# EAGLE design pcb_univ_3-101-0-x-rev1 (EAGLE 5.11)
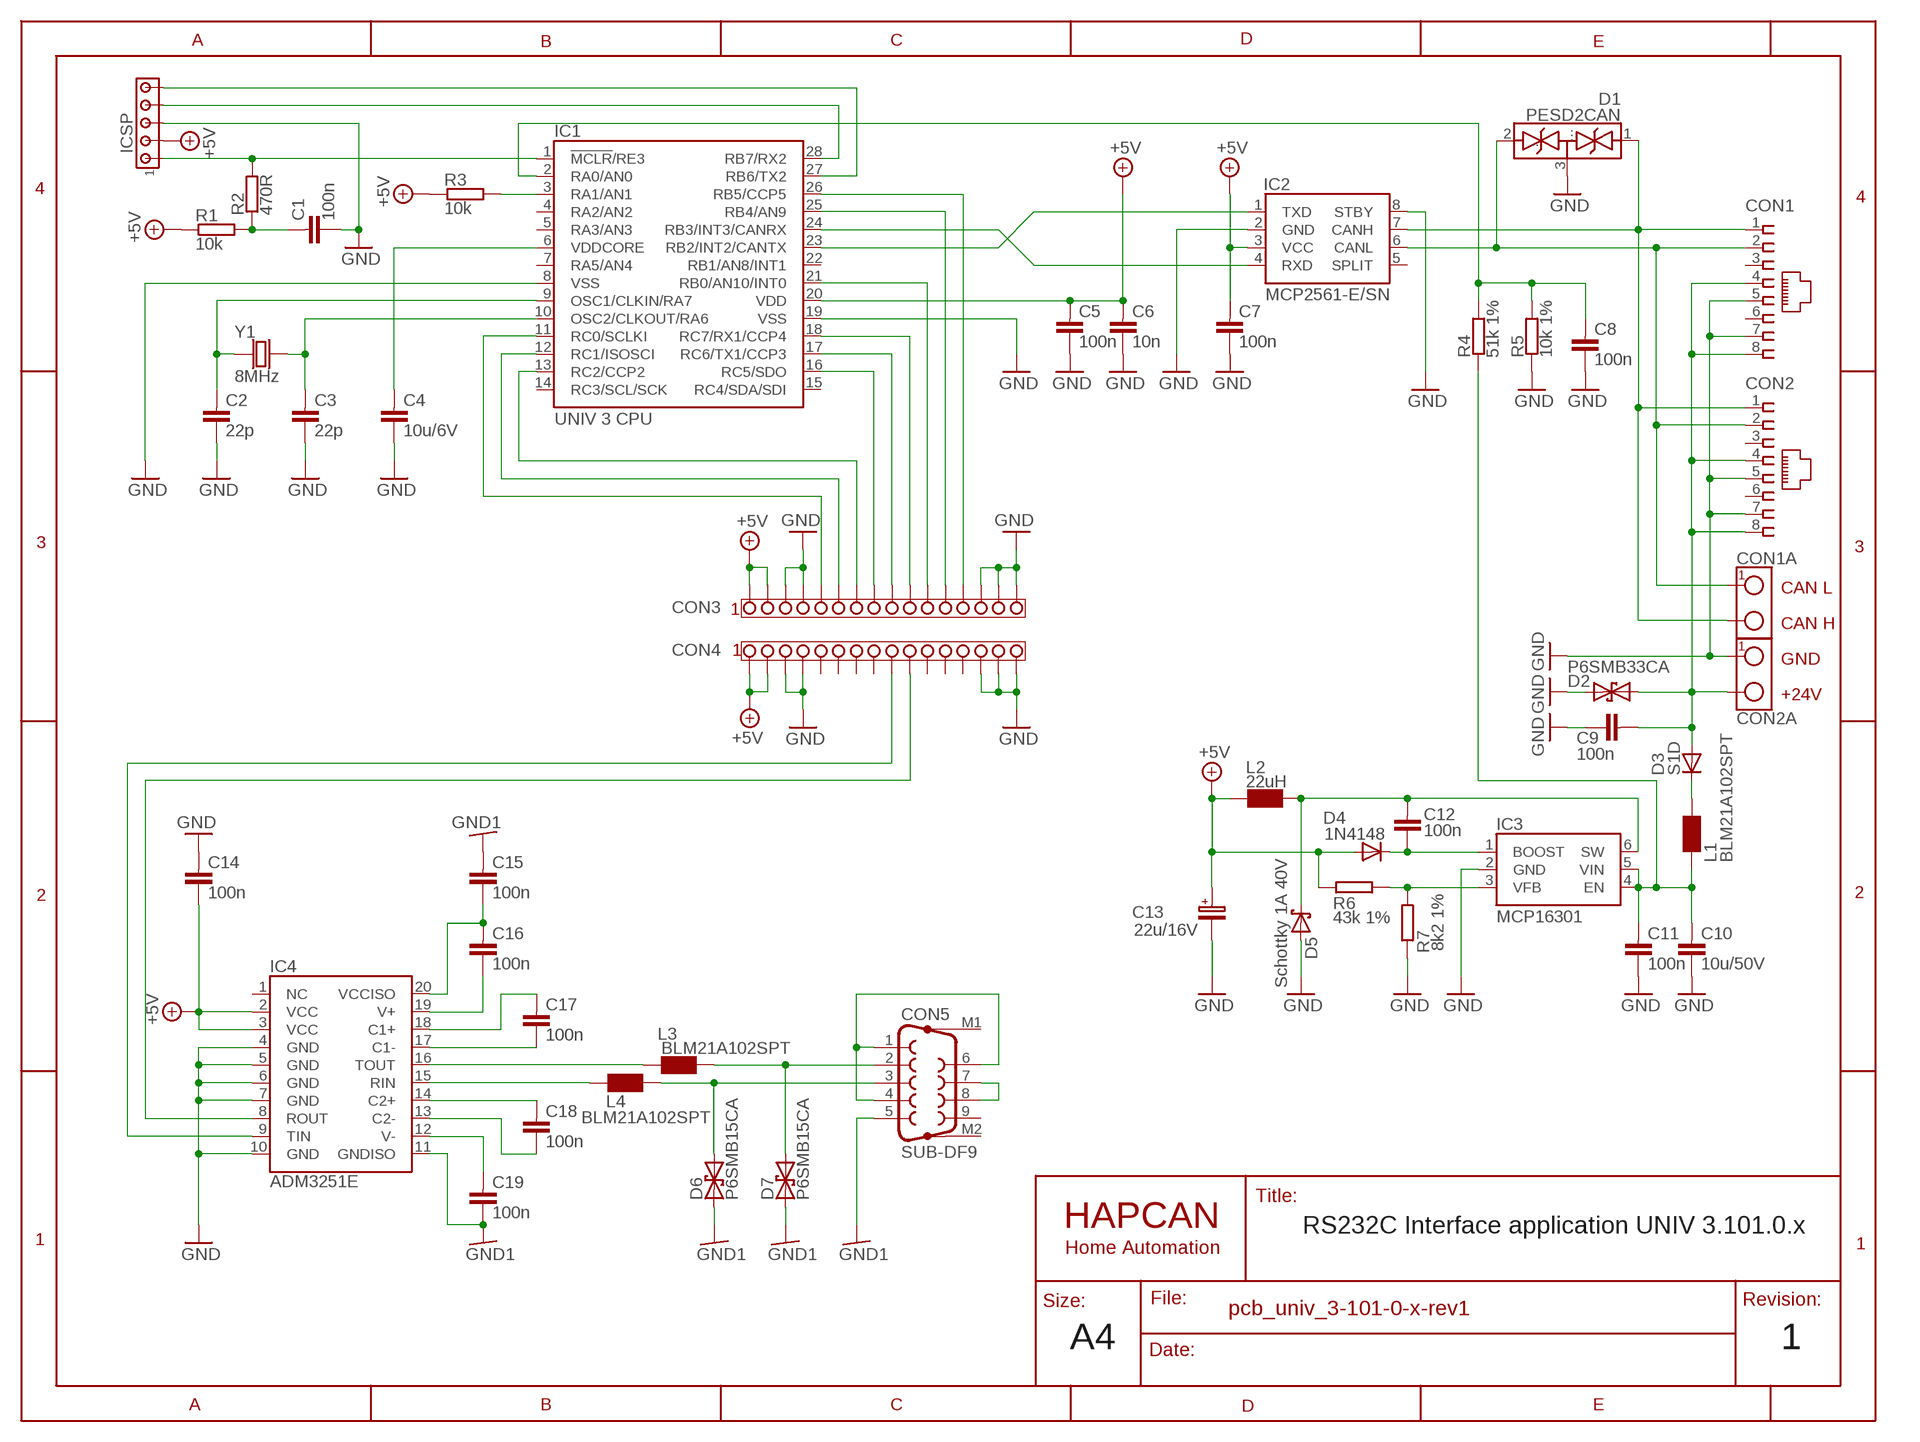
[diagram p0: schematic, sheet 1]

## Parts
C1  100n  CAPACITOR0805  [0805]
C2  22p  CAPACITOR0805  [0805]
C3  22p  CAPACITOR0805  [0805]
C4  10u/6V  CAPACITOR0805  [0805]
C5  100n  CAPACITOR0805  [0805]
C6  10n  CAPACITOR0805  [0805]
C7  100n  CAPACITOR0805  [0805]
C8  100n  CAPACITOR0805  [0805]
C9  100n  CAPACITOR0805  [0805]
C10  10u/50V  CAPACITOR1210  [1210]
C11  100n  CAPACITOR0805  [0805]
C12  100n  CAPACITOR0805  [0805]
C13  22u/16V  CAPACITOR-POLARIZED-SMC_B  [SMC_B]
C14  100n  CAPACITOR0805  [0805]
C15  100n  CAPACITOR0805  [0805]
C16  100n  CAPACITOR0805  [0805]
C17  100n  CAPACITOR0805  [0805]
C18  100n  CAPACITOR0805  [0805]
C19  100n  CAPACITOR0805  [0805]
CON1  RJ45-SOCKET  [RJ45-PCB-SOCKET]
CON1A  TERMINAL-2  TERMINAL-2-5X10,5MM  [ARK2-5X10,5MM]
CON2  RJ45-SOCKET  [RJ45-PCB-SOCKET]
CON2A  TERMINAL-2  TERMINAL-2-5X10,5MM  [ARK2-5X10,5MM]
CON3  CONNECTOR-16PINNORMAL  [CONNECTOR-16PIN]
CON4  CONNECTOR-16PINMIRRORED  [CONNECTOR-16PIN-REVERSED]
CON5  SUB-DF9  [SUB-D9FH-7.2MM]
D1  PESD2CAN  PESD2CANSOT-23  [SOT-23]
D2  P6SMB33CA  DIODE_TRANSIL  [DO-214_TRANSIL2]
D3  S1D  DIODE_DO-214  [DO-214]
D4  1N4148  DIODE_0805  [0805]
D5  Schottky 1A 40V  DIODE_TRANSIL1  [DO-214]
D6  P6SMB15CA  DIODE_TRANSIL  [DO-214_TRANSIL2]
D7  P6SMB15CA  DIODE_TRANSIL  [DO-214_TRANSIL2]
IC1  UNIV 3 CPU  UNIV3(CPU)  [UNIV3CPU]
IC2  MCP2561-E/SN  [SO-08]
IC3  MCP16301  MCP16301SOT23-6  [SOT-23-6]
IC4  ADM3251E  [SOW-20]
ICSP  HEADER5  [SIP-5]
L1  BLM21A102SPT  CHOKE0805  [0805]
L2  22uH  CHOKEDL16  [CHOKE-DL16]
L3  BLM21A102SPT  CHOKE0805  [0805]
L4  BLM21A102SPT  CHOKE0805  [0805]
R1  10k  RESISTOR0805  [0805]
R2  470R  RESISTOR0805  [0805]
R3  10k  RESISTOR0805  [0805]
R4  51k 1%  RESISTOR0805  [0805]
R5  10k 1%  RESISTOR0805  [0805]
R6  43k 1%  RESISTOR0805  [0805]
R7  8k2 1%  RESISTOR0805  [0805]
Y1  8MHz  CRYSTAL-HC49V  [CRYSTAL-HC49V]

## Nets
+5V: C5.1 C6.1 C7.1 C13.+ C14.2 CON3.1 CON3.2 CON4.1 CON4.2 D4.2(A) IC1.20(VDD) IC2.3(VCC) IC4.2(VCC) IC4.3(VCC) ICSP.2 L2.1 R1.1 R3.1 R6.1
GND: C1.2 C2.2 C3.2 C4.2 C5.2 C6.2 C7.2 C8.2 C9.2 C10.2 C11.2 C13.- C14.1 CON1.5 CON1.7 CON2.5 CON2.7 CON2A.1 CON3.3 CON3.4 CON3.14 CON3.15 CON3.16 CON4.3 CON4.4 CON4.14 CON4.15 CON4.16 D1.3(...) D2.C D5.A IC1.8(VSS) IC1.19(VSS) IC2.2(GND) IC2.8(STBY) IC3.2(GND) IC4.4(GND) IC4.5(GND) IC4.6(GND) IC4.7(GND) IC4.10(GND) ICSP.3 R5.1 R7.1
GNDIO: C15.1 C19.2 CON5.5 D6.C D7.C IC4.11(GNDISO) ; supply symbol labelled GND1
ICSP: IC1.1(!MCLR!/RE3) ICSP.1 R2.2
N$1: C18.2 IC4.13(C2-)
N$2: IC1.24(RB3/INT3/CANRX) IC2.4(RXD)
N$3: IC1.23(RB2/INT2/CANTX) IC2.1(TXD)
N$4: CON5.2 D7.A L3.1
N$5: C12.1 D5.C IC3.6(SW) L2.2
N$6: IC3.3(VFB) R6.2 R7.2
N$7: C1.1 R1.2 R2.1
N$8: C8.1 IC1.2(RA0/AN0) R4.2 R5.2
N$9: CON1.1 CON1A.2 CON2.1 D1.1(.) IC2.7(CANH)
N$10: IC1.28(RB7/RX2) ICSP.4
N$11: C2.1 IC1.9(OSC1/CLKIN/RA7) Y1.1
N$12: IC1.3(RA1/AN1) R3.2
N$13: CON1.2 CON1A.1 CON2.2 D1.2(..) IC2.6(CANL)
N$14: IC1.27(RB6/TX2) ICSP.5
N$15: C3.1 IC1.10(OSC2/CLKOUT/RA6) Y1.2
N$18: C10.1 C11.1 IC3.4(EN) IC3.5(VIN) L1.1 R4.1
N$19: CON5.3 D6.A L4.1
N$20: CON5.1 CON5.4 CON5.6
N$21: CON5.7 CON5.8
N$22: IC4.16(TOUT) L3.2
N$24: IC4.15(RIN) L4.2
N$25: C17.2 IC4.17(C1-)
N$26: C18.1 IC4.14(C2+)
N$27: C17.1 IC4.18(C1+)
N$29: CON3.9 IC1.17(RC6/TX1/CCP3)
N$30: CON3.8 IC1.16(RC5/SDO)
N$31: C16.2 IC4.19(V+)
N$32: CON3.7 IC1.13(RC2/CCP2)
N$33: CON3.10 IC1.18(RC7/RX1/CCP4)
N$34: C15.2 C16.1 IC4.20(VCCISO)
N$35: C19.1 IC4.12(V-)
N$37: CON4.10 IC4.8(ROUT)
N$38: C12.2 D4.1(C) IC3.1(BOOST)
N$41: CON4.9 IC4.9(TIN)
N$47: CON3.6 IC1.12(RC1/ISOSCI)
N$48: CON3.5 IC1.11(RC0/SCLKI)
N$51: CON3.11 IC1.21(RB0/AN10/INT0)
N$52: CON3.13 IC1.26(RB5/CCP5)
N$54: CON3.12 IC1.25(RB4/AN9)
N$56: C4.1 IC1.6(VDDCORE)
N$59: C9.1 CON1.4 CON1.8 CON2.4 CON2.8 CON2A.2 D2.A D3.A
N$61: D3.C L1.2
Unconnected: CON1.3 CON1.6 CON2.3 CON2.6 CON4.5 CON4.6 CON4.7 CON4.8 CON4.11 CON4.12 CON4.13 CON5.9 CON5.M1(G1) CON5.M2(G2) IC1.4(RA2/AN2) IC1.5(RA3/AN3) IC1.7(RA5/AN4) IC1.14(RC3/SCL/SCK) IC1.15(RC4/SDA/SDI) IC1.22(RB1/AN8/INT1) IC2.5(SPLIT) IC4.1(NC)

## Notes on the sheet
- CAN L
- CON3 | 1
- CAN H
- CON4 | 1
- GND
- +24V
- RS232C Interface application UNIV 3.101.0.x
- A4 | 1

## Library data of the parts
C1-C12 C14-C19 = HAPCAN_devices - UNIV3:CAPACITOR: HAPCAN Capacitor
C13 = HAPCAN_devices - UNIV3:CAPACITOR-POLARIZED: HAPCAN Polarazied Capacitor
CON1 CON2 = HAPCAN_devices - UNIV3:RJ45-SOCKET: HAPCAN RJ45 socket
CON1A CON2A = HAPCAN_devices - UNIV3:TERMINAL-2: HAPCAN Terminal Block - 2 way
CON3 CON4 = HAPCAN_devices - UNIV3:CONNECTOR-16PIN: 16pin connector 2.54 raster
CON5 = HAPCAN_devices - UNIV3:SUB-DF9: HAPCAN SUB-D 9 pin female connector
D1 = HAPCAN_devices - UNIV3:PESD2CAN: CAN bus ESD protection diode
D2 D6 D7 = HAPCAN_devices - UNIV3:DIODE_TRANSIL: Transil diode
D3 D4 = HAPCAN_devices - UNIV3:DIODE: HAPCAN Rectifier Diode
D5 = HAPCAN_devices - UNIV3:DIODE_TRANSIL1: HAPCAN Unidirectional transil diode
IC1 = HAPCAN_devices - UNIV3:UNIV3(CPU): HAPCAN Microcontroller UNIV 3 (CPU)
IC2 = HAPCAN_devices - UNIV3:MCP2561: HAPCAN CAN Tranceiver
IC3 = HAPCAN_devices - UNIV3:MCP16301: High Voltage Input Integrated Switch Step-Down Regulator
IC4 = HAPCAN_devices - UNIV3:ADM3251E: RS232C isolated transceiver
ICSP = HAPCAN_devices - UNIV3:HEADER5: HAPCAN Header 5
L1-L4 = HAPCAN_devices - UNIV3:CHOKE: Choke
R1-R7 = HAPCAN_devices - UNIV3:RESISTOR: HAPCAN Resistor
Y1 = HAPCAN_devices - UNIV3:CRYSTAL: HAPCAN Crystal

## Board
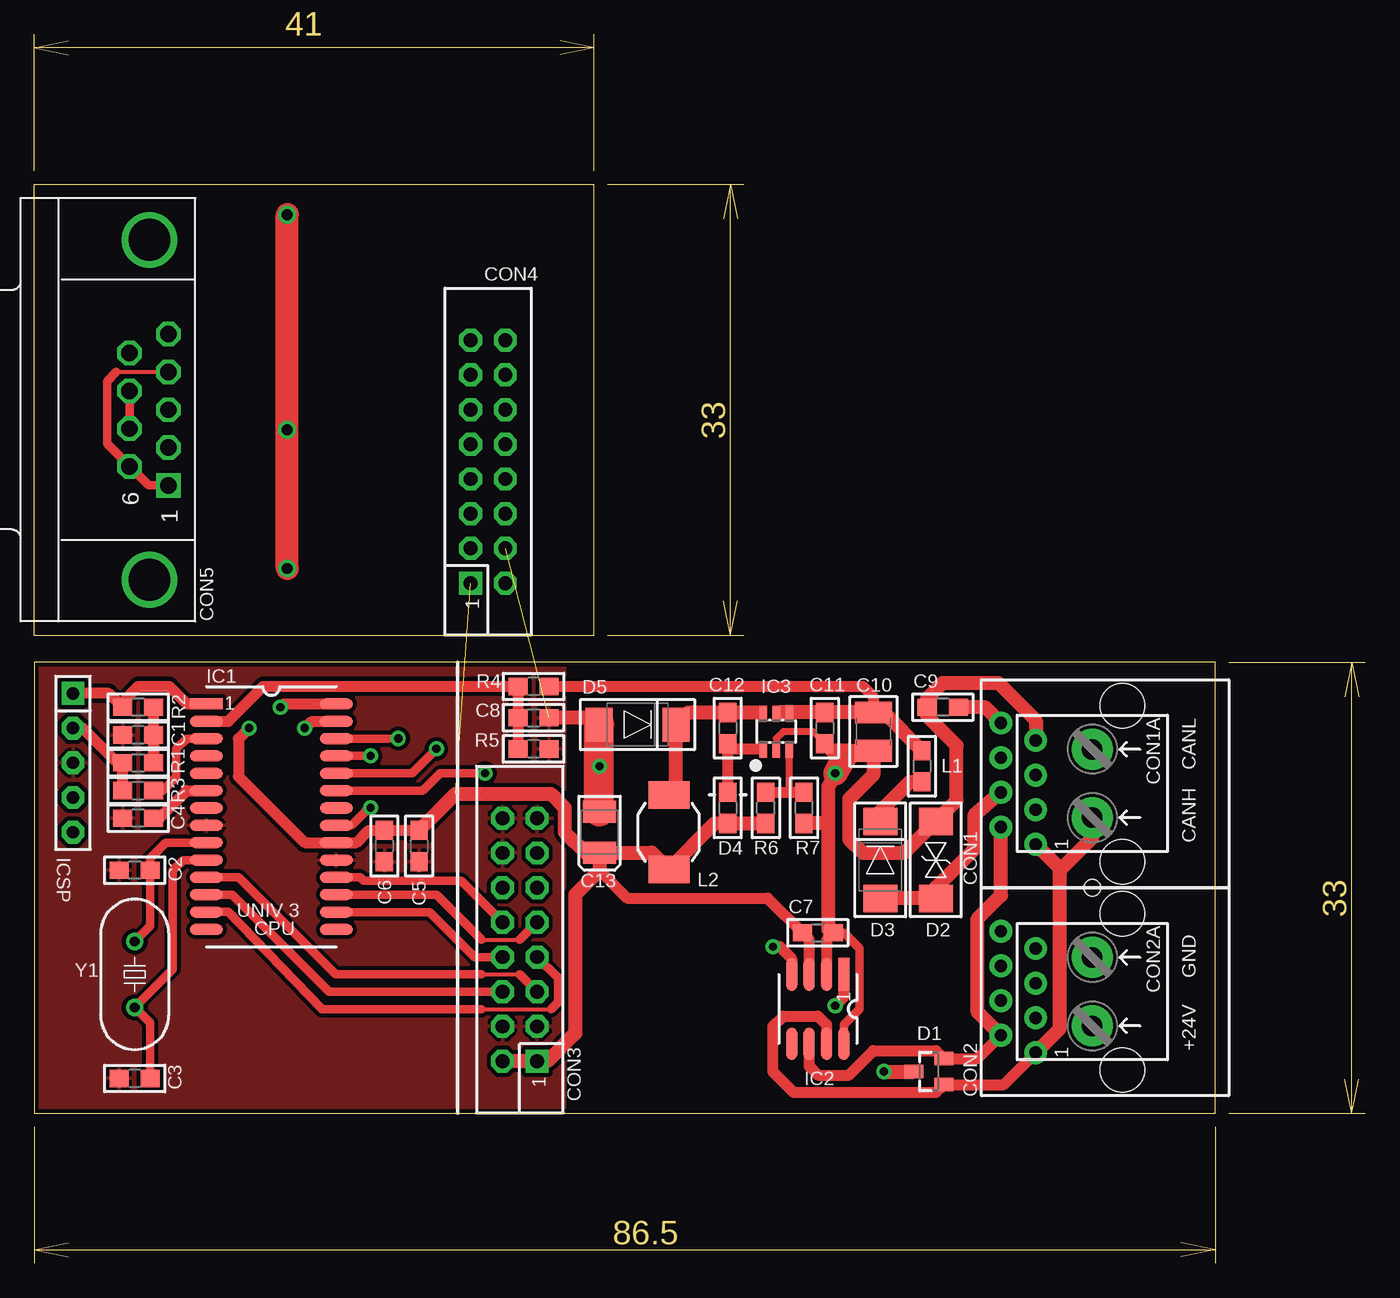
[diagram p1: board, top side]
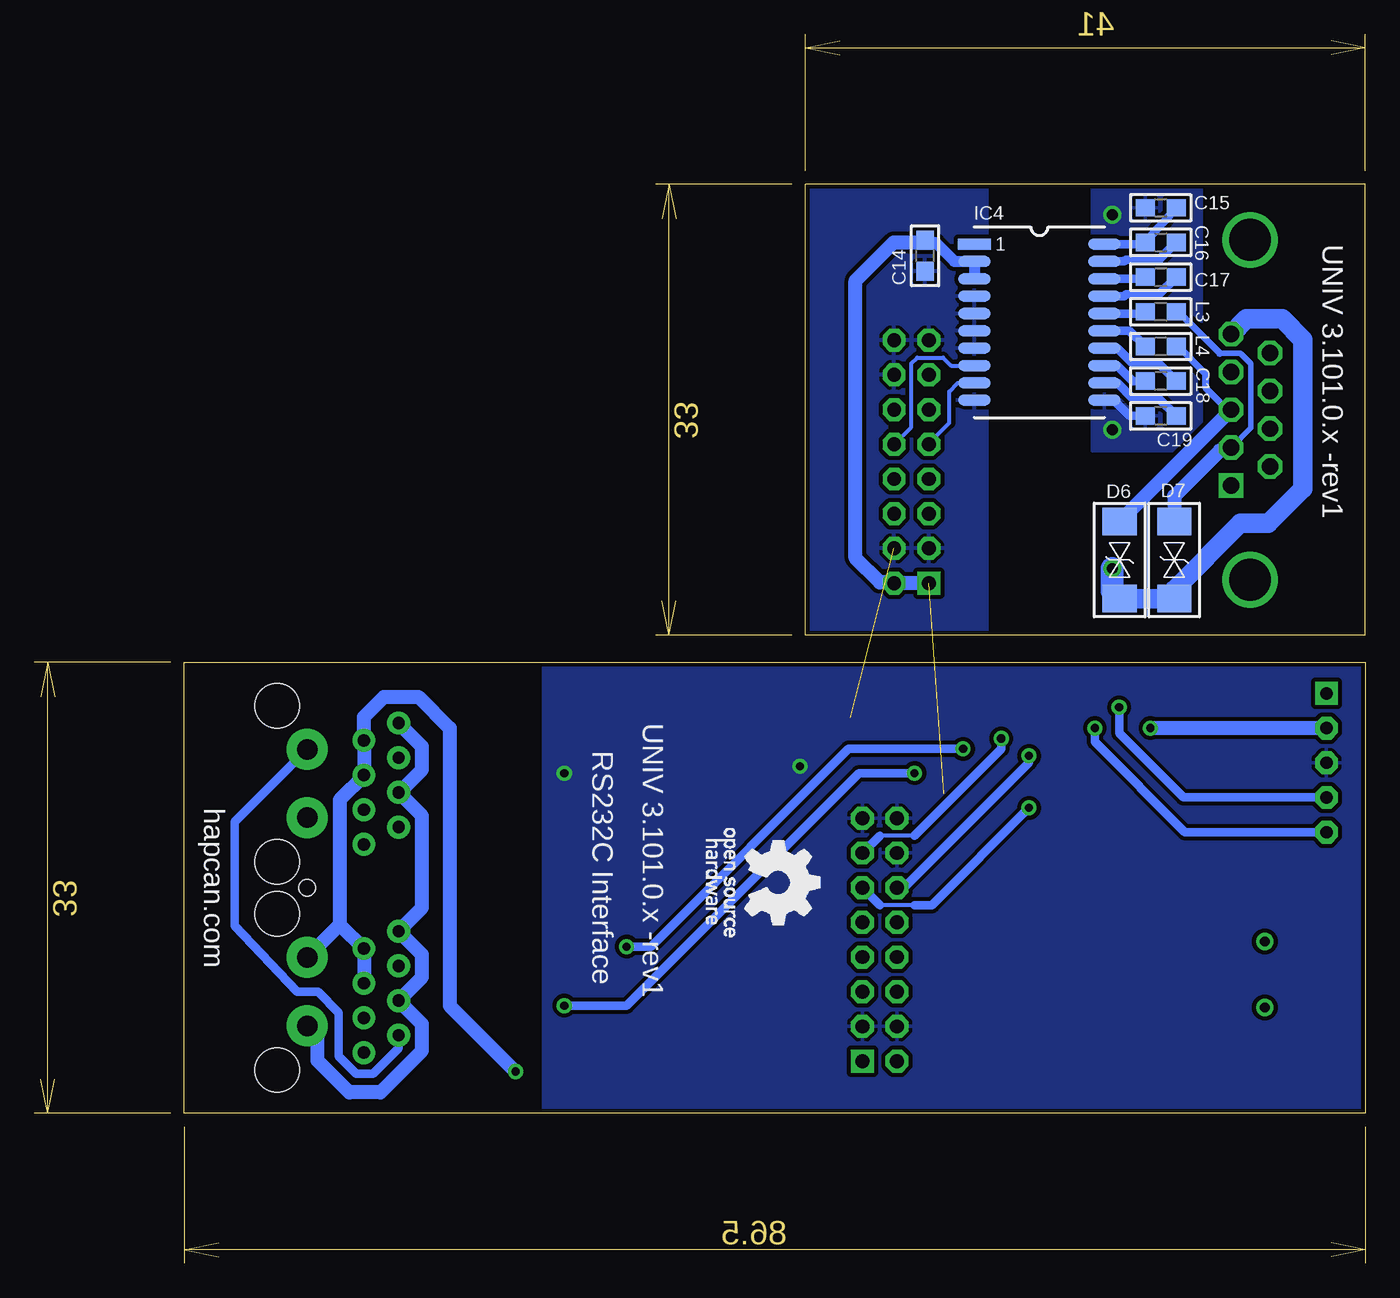
[diagram p2: board, bottom side, seen from below]

Size 97.5 x 90 mm. Coordinates in mm from the lower left corner, seen from the top.
Outline: 0,10 0,1
Outline: 0,1 0,0
Outline: 86.5,10 86.5,1
Outline: 86.5,1 86.5,0
Outline: 0,1 86.5,1
Outline: 86.5,1 84,1.5
Outline: 86.5,1 84,0.5
Outline: 0,1 2.5,1.5
Outline: 0,1 2.5,0.5
Outline: 41,80 41,89
Outline: 41,89 41,90
Outline: 0,80 0,89
Outline: 0,89 0,90
Outline: 41,89 0,89
Outline: 0,89 2.5,88.5
Outline: 0,89 2.5,89.5
Outline: 41,89 38.5,88.5
Outline: 41,89 38.5,89.5
Outline: 42,46 51,46
Outline: 51,46 52,46
Outline: 42,79 51,79
Outline: 51,79 52,79
Outline: 51,46 51,79
Outline: 51,79 50.5,76.5
Outline: 51,79 51.5,76.5
Outline: 51,46 50.5,48.5
Outline: 51,46 51.5,48.5
Outline: 87.5,11 96.5,11
Outline: 96.5,11 97.5,11
Outline: 87.5,44 96.5,44
Outline: 96.5,44 97.5,44
Outline: 96.5,11 96.5,44
Outline: 96.5,44 96,41.5
Outline: 96.5,44 97,41.5
Outline: 96.5,11 96,13.5
Outline: 96.5,11 97,13.5
Outline: 86.5,11 86.5,44 0,44 0,11 86.5,11
Outline: 0,46 41,46 41,79 0,79 0,46
Copper layers (1*16): Top 0.035mm / dielectric 1.5mm / Bottom 0.035mm
Design rules "HAPCAN-Drc": minimum track width 10mil, minimum drill 0.5mm, track to track 10mil, track to pad 10mil, pad to pad 10mil, via to via 10mil, smd to smd 0mil, copper to edge 10mil, drill to drill 8mil, minimum pad ring 10mil, minimum via ring 10mil, stop-mask expansion 4mil, vias tented up to drill 0mil, thermal gap 10mil
Holes 1.2 mm at 77.5,27.5
tKeepout: 4 lines

### Footprints (pad centres in the part's own frame; a part is rotated, then mirrored left to right if it is on the bottom)
0805 = smd 1.397 x 1.27: 1 -1.143,0; 2 1.143,0
1210 = smd 1.6 x 2.7: 1 -1.4,0; 2 1.4,0
SMC_B = smd 1.6 x 2.4: + -1.5,0; - 1.5,0
RJ45-PCB-SOCKET@1 = drill 0.9 pad 1.676 round: 1 -4.445,6.35; 2 -3.175,8.89; 3 -1.905,6.35; 4 -0.635,8.89; 5 0.635,6.35; 6 1.905,8.89; 7 3.175,6.35; 8 4.445,8.89 | hole 3.251: -5.715,0; 5.715,0
ARK2-5X10,5MM = drill 1.5 pad 3 round: 1 -2.5,0; 2 2.5,0
CONNECTOR-16PIN = drill 1.016 pad 1.676 square: 1 -8.89,-1.27 | drill 1.016 pad 1.676 octagon: 2 -8.89,1.27; 3 -6.35,-1.27; 4 -6.35,1.27; 5 -3.81,-1.27; 6 -3.81,1.27; 7 -1.27,-1.27; 8 -1.27,1.27; 9 1.27,-1.27; 10 1.27,1.27; 11 3.81,-1.27; 12 3.81,1.27; 13 6.35,-1.27; 14 6.35,1.27; 15 8.89,-1.27; 16 8.89,1.27
CONNECTOR-16PIN-REVERSED = drill 1.016 pad 1.676 square: 1 -8.89,1.27 | drill 1.016 pad 1.676 octagon: 2 -8.89,-1.27; 3 -6.35,1.27; 4 -6.35,-1.27; 5 -3.81,1.27; 6 -3.81,-1.27; 7 -1.27,1.27; 8 -1.27,-1.27; 9 1.27,1.27; 10 1.27,-1.27; 11 3.81,1.27; 12 3.81,-1.27; 13 6.35,1.27; 14 6.35,-1.27; 15 8.89,1.27; 16 8.89,-1.27
SUB-D9FH-7.2MM = drill 1.194 pad 1.676 square: 1 5.537,2.033 | drill 1.194 pad 1.676 octagon: 2 2.769,2.033; 3 0,2.033; 4 -2.769,2.033; 5 -5.537,2.033; 6 4.153,-0.81; 7 1.384,-0.81; 8 -1.384,-0.81; 9 -4.153,-0.81 | drill 3.048 round: M1 -12.446,0.635; M2 12.446,0.635
SOT-23 = smd 1 x 1.4: 1 -0.95,-1.1; 2 0.95,-1.1; 3 0,1.1
DO-214_TRANSIL2@1 = smd 2 x 2.5: A 2.82,0; C -2.82,0
DO-214 = smd 2 x 2.5: A 2.82,0; C -2.82,0
DO-214_TRANSIL2@2 = smd 2 x 2.5: A 2.82,0; C -2.82,0
UNIV3CPU@1 = smd 2.4 x 0.8: 1 -4.763,8.255; 2 -4.763,6.985; 3 -4.763,5.715; 4 -4.763,4.445; 5 -4.763,3.175; 6 -4.763,1.905; 7 -4.763,0.635; 8 -4.763,-0.635; 9 -4.763,-1.905; 10 -4.763,-3.175; 11 -4.763,-4.445; 12 -4.763,-5.715; 13 -4.763,-6.985; 14 -4.763,-8.255; 15 4.763,-8.255; 16 4.763,-6.985; 17 4.763,-5.715; 18 4.763,-4.445; 19 4.763,-3.175; 20 4.763,-1.905; 21 4.763,-0.635; 22 4.763,0.635; 23 4.763,1.905; 24 4.763,3.175; 25 4.763,4.445; 26 4.763,5.715; 27 4.763,6.985; 28 4.763,8.255
SO-08 = smd 2.4 x 0.8: 1 -2.54,1.905; 2 -2.54,0.635; 3 -2.54,-0.635; 4 -2.54,-1.905; 5 2.54,-1.905; 6 2.54,-0.635; 7 2.54,0.635; 8 2.54,1.905
SOT-23-6 = smd 0.55 x 1.2: 1 -0.95,-1.3; 2 0,-1.3; 3 0.95,-1.3; 4 0.95,1.3; 5 0.003,1.3; 6 -0.95,1.3
SOW-20 = smd 2.4 x 0.8: 1 -4.763,5.715; 2 -4.763,4.445; 3 -4.763,3.175; 4 -4.763,1.905; 5 -4.763,0.635; 6 -4.763,-0.635; 7 -4.763,-1.905; 8 -4.763,-3.175; 9 -4.763,-4.445; 10 -4.763,-5.715; 11 4.763,-5.715; 12 4.763,-4.445; 13 4.763,-3.175; 14 4.763,-1.905; 15 4.763,-0.635; 16 4.763,0.635; 17 4.763,1.905; 18 4.763,3.175; 19 4.763,4.445; 20 4.763,5.715
SIP-5 = drill 0.9 pad 1.676 square: 1 -5.08,0 | drill 0.9 pad 1.676 octagon: 2 -2.54,0; 3 0,0; 4 2.54,0; 5 5.08,0
CHOKE-DL16 = smd 2 x 3: 1 -2.73,0; 2 2.73,0
CRYSTAL-HC49V = drill 0.7 pad 1.27 round: 1 -2.413,0; 2 2.413,0

### Placement (x,y rotation side)
C1  7.62,38.69 180 top
C2  7.37,28.78 180 top
C3  7.37,13.54 180 top
C4  7.62,32.59 180 top
C5  28.19,30.56 270 top
C6  25.65,30.56 270 top
C7  57.4,24.21 0 top
C8  36.58,39.96 0 top
C9  66.55,40.72 180 top
C10  61.47,38.94 270 top
C11  57.91,39.19 270 top
C12  50.8,39.19 270 top
C13  41.4,31.57 90 top
C14  32.25,73.78 90 bottom
C15  14.99,77.29 0 bottom
C16  14.99,74.75 0 bottom
C17  14.99,72.21 0 bottom
C18  14.99,64.59 180 bottom
C19  14.99,62.05 180 bottom
CON1  [RJ45-PCB-SOCKET@1]  79.7,35.12 90 top
CON1A  77.5,35.14 270 top
CON2  [RJ45-PCB-SOCKET@1]  79.7,19.88 90 top
CON2A  77.5,19.9 270 top
CON3  35.57,23.7 90 top
CON4  33.24,58.7 90 top
CON5  7.8,62.5 270 top
D1  65.53,14.05 90 top
D2  P6SMB33CA  [DO-214_TRANSIL2@1]  66.04,29.54 270 top
D3  61.98,29.54 270 top
D4  50.8,33.35 270 top
D5  44.2,39.45 180 top
D6  P6SMB15CA  [DO-214_TRANSIL2@2]  18,51.5 90 bottom
D7  P6SMB15CA  [DO-214_TRANSIL2@2]  14,51.5 90 bottom
IC1  UNIV 3 CPU  [UNIV3CPU@1]  17.37,32.71 0 top
IC2  57.4,18.62 270 top
IC3  54.36,38.94 0 top
IC4  23.88,68.91 0 bottom
ICSP  2.84,36.65 270 top
L1  65.02,36.4 270 top
L2  46.48,31.57 90 top
L3  14.99,69.67 180 bottom
L4  14.99,67.13 180 bottom
R1  7.62,36.65 0 top
R2  7.62,40.72 180 top
R3  7.62,34.62 0 top
R4  36.58,42.24 180 top
R5  36.58,37.67 180 top
R6  53.59,33.35 90 top
R7  56.39,33.35 90 top
Y1  7.37,21.16 270 top

### Tracks (layer width: path | path; a pad name or v marks a point on that pad's centre or on a via)
+5V  (via drill 0.6 pad 1.02)  (1 unrouted)
  Top 0.406: IC2.3
  Top 0.813: C5.1 C6.1 24.51,31.7 23.61,30.8 IC1.20 19.82,30.8 14.98,35.65 14.98,38.42 v15.75,39.19 | 41.4,28.78 43.43,26.75 53.72,26.75 C7.1 56.77,23.7 56.76,23.7 IC2.3 | R3.1 R1.1 6.1,36.65 3.56,39.19 ICSP.2
  Top 1.016: R6.1 D4.2 49.85,32.21 L2.1 45.25,30.07 C13.+ | C5.1 30.86,34.37 37.85,34.37 38.86,33.35 38.86,31.57 40.39,30.05 41.38,30.05 C13.+ | C13.+ 41.4,28.78 39.62,27 39.62,16.84 37.59,14.81 CON3.1 CON3.2
  Bottom 0.813: IC4.3 IC4.2 30.1,73.36 31.5,74.75 32.08,74.75 C14.2
  Bottom 1.016: ICSP.2 v15.75,39.19 | CON4.1 CON4.2 34.56,49.86 35.56,49.86 37.34,51.64 37.34,71.96 34.54,74.75 32.08,74.75
GND  (via drill 0.6 pad 1.02)  (1 unrouted)
  Top 0.406: IC2.2 | IC2.8 | 58.42,37.54 C11.2 57.02,38.94
  Top 0.508: IC3.2 54.36,38.43 54.86,38.94 57.02,38.94
  Top 0.61: IC2.8 59.3,17.47 60.45,18.62 60.45,23.06 59.31,24.21 C7.2 | v41.4,36.4 41.01,37.3 41.01,39.82
  Top 0.813: IC2.2 58.03,23.7 C7.2
  Top 1.016: 59.69,37.54 58.42,37.54 | 58.17,32.08 58.17,24.46 58.42,24.21 C7.2 | 58.17,32.08 58.17,34.88 v58.67,35.89 | 59.44,37.16 59.69,37.54 | R7.1 58.04,32.21 58.17,32.08 | D5.A 41.01,39.82 40.87,39.96 C8.2 | 59.69,37.54 C10.2 61.47,35.77 59.69,33.99 59.69,31.07 60.71,30.05 63.73,30.05 D2.C 67.56,33.89 67.56,37.92 65.41,40.08 C9.2 65.41,41.35 66.55,42.5 70.61,42.5 73.35,39.76 CON1.7 | v62.23,14.05 D1.3
  Top 1.778: v58.67,35.89 59.44,37.16
  Top 2.184: C13.- 41.38,33.1 D5.A
  Bottom 1.016: CON2.5 CON2.7 75.11,24.81 | 75.11,24.81 75.11,33.94 73.35,35.69 CON1.5 CON1.7 73.35,40.01 71.88,41.48 69.34,41.48 67.06,39.19 67.06,18.87 v62.23,14.05 | CON2A.1 75.11,24.79 75.11,24.81
  pour Bottom (isolate 0.305): 0,11 60.2,11 60.2,44.02 0,44.02
  pour Top (isolate 0.305): 0,11 38.86,11 38.86,44.02 0,44.02
  pour Bottom (isolate 0.305): 41,46 41,79 27.75,79 27.75,46
GNDIO  (via drill 0.8)
  Top 1.016: v18.54,50.88 v18.54,61.04
  Top 1.676: v18.54,50.88 v18.54,76.79
  Bottom 0.61: IC4.11 18.41,63.2 17.27,62.05 C19.2
  Bottom 1.422: 18.54,49.22 arc-90 D6.C D7.C 14,49.32 9.14,54.18 7.11,54.18 4.57,56.72 4.57,67.64 6.1,69.17 8.7,69.17 CON5.5
  Bottom 1.676: 18.54,49.22 v18.54,50.88
  pour Bottom (isolate 0.305): 20,79 12,79 12,59.5 20,59.5
ICSP
  Top 0.813: IC1.1 11.19,40.96 9.91,42.24 7.62,42.24 6.48,41.1 R2.2 5.46,41.73 ICSP.1
N$1
  Bottom 0.61: IC4.13 18.16,65.74 17.02,64.59 C18.2
N$2  (via drill 0.6 pad 1.02)
  Top 0.406: IC2.4
  Top 0.61: IC1.24 27.68,35.88 v29.46,37.67
  Top 0.813: v54.1,23.19 54.61,23.19 55.5,22.3 55.49,22.3 IC2.4
  Bottom 0.61: v29.46,37.67 37.85,37.67 52.32,23.19 v54.1,23.19
N$3  (via drill 0.6 pad 1.02)
  Top 0.61: IC1.23 28.44,34.61 29.72,35.89 v33.02,35.89
  Top 0.813: v58.67,18.87 59.31,19.51 IC2.1
  Bottom 0.61: v33.02,35.89 37.08,35.89 54.1,18.87 v58.67,18.87
N$4
  Bottom 0.406: 10.67,66.63 9.14,66.63 8.38,65.86 8.38,61.18 CON5.2
  Bottom 0.508: L3.1 13.72,69.67 10.67,66.63
  Bottom 1.016: D7.A 14,56.18 10.67,59.51 10.05,59.51 CON5.2
N$5
  Top 0.254: 53.16,40.34 53.31,40.34 IC3.6
  Top 1.016: L2.2 47.02,34.84 D5.C 47.91,40.34 C12.1 53.16,40.34
N$6
  Top 0.508: 55.31,34.56 IC3.3
  Top 0.813: R6.2 55.63,34.5 | 55.63,34.5 R7.2 | 55.63,34.5 55.31,34.56
N$7
  Top 0.813: R2.1 R1.2 C1.1
N$8
  Top 0.813: R5.2 C8.1 R4.2 16.76,42.24 14.21,39.69 IC1.2
N$9
  Top 0.406: IC2.7
  Top 0.813: CON2.1 71.01,13.1 D1.1 66.06,12.52 55.63,12.52 54.1,14.05 54.1,17.35 54.86,18.11 57.4,18.11 58.04,17.48 58.03,17.48 IC2.7
  Top 1.016: CON2.1 75.11,17.19 75.11,28.78 | 75.11,28.78 75.11,28.92 CON1.1 | CON1A.2 77.5,31.17 75.11,28.78
N$10  (via drill 0.6 pad 1.02)
  Top 0.813: IC1.28 18.28,40.96 v18.03,40.72
  Bottom 0.61: ICSP.4 13.34,34.11 18.03,38.81 v18.03,40.72
N$11
  Top 0.61: Y1.1 8.51,24.72 C2.1 8.51,29.67 9.64,30.8 IC1.9
N$12
  Top 0.61: IC1.3 11.17,38.42 10.41,37.67 10.41,35.64 9.4,34.62 R3.2
N$13
  Top 0.406: IC2.6
  Top 0.813: CON2.2 69.1,15 D1.2 66.06,15.57 61.47,15.57 59.69,13.79 57.4,13.79 56.77,14.43 IC2.6
  Top 1.016: CON2.2 69.09,18.43 69.09,25.22 70.81,26.95 CON1.2
  Bottom 0.61: CON2.2 70.81,15.75 72.67,13.9 73.91,13.9 75.18,15.17 75.18,18.37 76.71,19.89 78.23,19.89 82.8,24.72 82.8,32.34 CON1A.1
N$14  (via drill 0.6 pad 1.02)
  Top 0.813: IC1.27 20.33,39.69 v19.81,39.19
  Bottom 0.61: ICSP.5 13.21,31.57 19.81,38.18 v19.81,39.19
N$15
  Top 0.61: C3.1 8.51,17.6 Y1.2 10.16,21.54 10.16,28.78 10.91,29.53 IC1.10
N$18
  Top 0.254: IC3.5 IC3.4
  Top 0.813: R4.1 60.71,42.24 61.47,41.48 C10.1
  Top 1.016: IC3.4 54.64,40.34 C11.1 57.66,40.34 C10.1 62.23,40.34 L1.1
N$19
  Bottom 0.508: 13.72,67.13 11.68,65.1 11.68,64.09 10.1,62.5
  Bottom 0.61: 13.72,67.13 L4.1 | CON5.3 10.1,62.5
  Bottom 1.016: D6.A 9.83,62.49 CON5.3
N$20
  Top 0.305: 6.01,65.27 CON5.4
  Top 0.61: CON5.1 8.37,56.96 CON5.6 5.33,60 5.33,64.59 6.01,65.27
N$21
  Top 0.61: CON5.7 CON5.8
N$22
  Bottom 0.61: IC4.16 16.26,69.55 L3.2
N$24
  Bottom 0.61: IC4.15 17.27,68.28 L4.2
N$25
  Bottom 0.61: IC4.17 17.65,70.82 17.53,70.94 15.11,70.94 C17.2
N$26
  Bottom 0.61: IC4.14 18.16,67.01 17.02,65.86 15.11,65.86 C18.1
N$27
  Bottom 0.61: IC4.18 16.26,72.09 C17.1
N$29
  Top 0.305: 32.77,23.7 35.57,23.7
  Top 0.61: IC1.17 29.47,26.99 32.77,23.7 | 35.57,23.7 CON3.9
N$30
  Top 0.61: CON3.8 32.26,22.43 28.96,25.72 IC1.16
N$31
  Bottom 0.61: IC4.19 17.65,73.36 17.53,73.48 15.11,73.48 C16.2
N$32
  Top 0.305: 32.77,18.62 37.85,18.62
  Top 0.61: CON3.7 38.35,20.92 38.35,19.13 37.85,18.62 | IC1.13 12.62,25.73 14.22,25.73 21.08,18.62 32.77,18.62
N$33
  Top 0.61: IC1.18 23.89,28.26 24.13,28.02 31.25,28.02 CON3.10
N$34
  Bottom 0.61: IC4.20 16.26,74.63 C16.1 C15.2
N$35
  Bottom 0.61: IC4.12 18.16,64.47 17.02,63.32 15.11,63.32 C19.1
N$37
  Bottom 0.305: IC4.8 30.35,65.74 30.94,66.32 32.82,66.32 33.25,65.89 33.25,61.23 CON4.10
N$38
  Top 0.254: IC3.1 53.12,37.64 53.09,37.67
  Top 0.813: D4.1 C12.2 51.18,37.67 53.09,37.67
N$41
  Bottom 0.305: 31.97,60.06 30.48,61.55 30.48,63.83 29.84,64.47 IC4.9
  Bottom 0.508: CON4.9 31.97,60.06 | IC4.9 28.77,64.34
N$47
  Top 0.61: CON3.6 21.59,19.89 14.49,26.99 IC1.12
N$48
  Top 0.305: 32.77,21.16 35.57,21.16
  Top 0.61: 35.57,21.16 CON3.5 | IC1.11 14.99,28.26 22.1,21.16 32.77,21.16
N$51  (via drill 0.6 pad 1.02)
  Top 0.61: IC1.21 23.26,32.07 24.54,33.35 v24.64,33.35
  Bottom 0.305: 33.02,26.24 35.57,26.24
  Bottom 0.61: v24.64,33.35 31.75,26.24 33.02,26.24 | 35.57,26.24 CON3.11
N$52  (via drill 0.6 pad 1.02)
  Top 0.61: IC1.26 25.9,38.42 v26.67,38.43
  Bottom 0.305: 33.02,31.32 35.57,31.32
  Bottom 0.61: 35.57,31.32 CON3.13 | v26.67,38.43 26.67,37.67 33.02,31.32
N$54  (via drill 0.6 pad 1.02)
  Top 0.61: IC1.25 v24.63,37.15 v24.64,37.16
  Bottom 0.61: v24.64,37.16 24.64,36.65 33.78,27.51 CON3.12
N$56
  Top 0.813: IC1.6 11.17,34.61 9.14,32.59 C4.1
N$59
  Top 1.016: D3.A D2.A 66.04,27.51 68.83,30.3 68.83,32.76 CON1.4 | C9.1 69.66,40.72 CON1.8
  Bottom 1.016: CON1.8 69.09,37.84 69.09,36.15 70.75,34.48 CON1.4 69.09,32.76 69.09,26.05 CON2.8 69.09,22.6 69.09,20.97 CON2.4 69.09,17.52 69.09,15.57 72.14,12.52 74.42,12.52 76.74,14.84 76.74,16.64 CON2A.2
N$61
  Top 1.016: L1.2 64.14,35.26 61.98,33.1 D3.C

### Text on the board
Dimension: 41 | 33 | 33 | 86.5
tPlace: CANL | CANH | GND | +24V
bPlace: UNIV 3.101.0.x -rev1 | UNIV 3.101.0.x -rev1 | RS232C Interface | hapcan.com
tKeepout: Eagle Light Keep Out Size